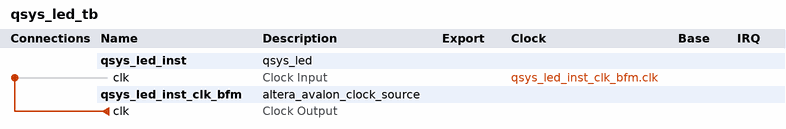
[diagram p0: system contents]
# Platform Designer (Qsys) system qsys_led_tb
# Parameters at their usual value, and those the tool derives, are not listed.
package require -exact qsys 11.1
create_system qsys_led_tb
set_project_property DEVICE_FAMILY CYCLONEIII

add_instance qsys_led_inst qsys_led 1.0

add_instance qsys_led_inst_clk_bfm altera_avalon_clock_source 11.1
set_instance_parameter_value qsys_led_inst_clk_bfm CLOCK_RATE 50

# connections
add_connection qsys_led_inst_clk_bfm.clk qsys_led_inst.clk clock

save_system qsys_led_tb.qsys
